# EAGLE design RingTop (EAGLE 9.6.2)
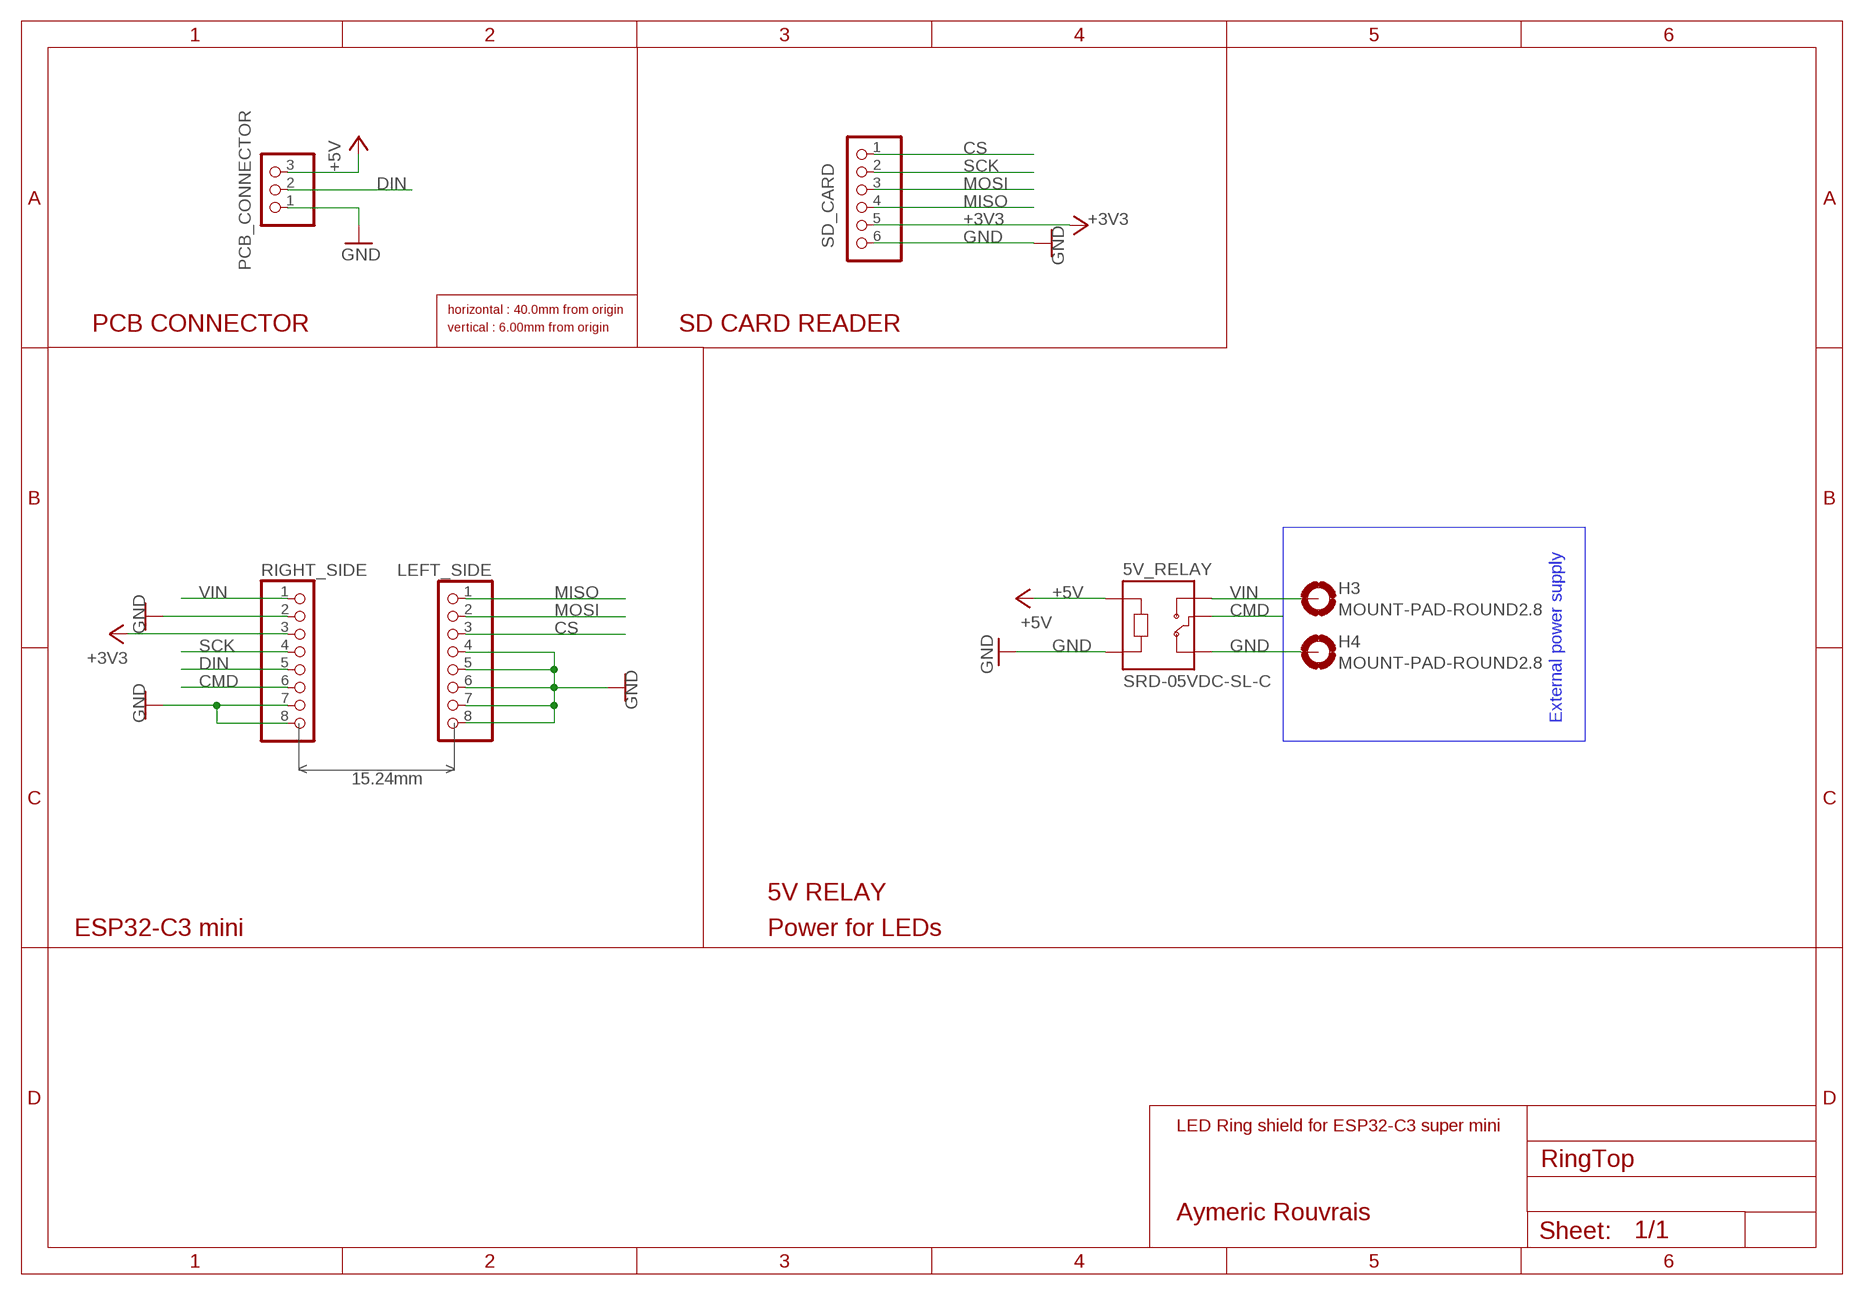
[diagram p0: schematic, sheet 1]

## Parts
5V_RELAY  SRD-05VDC-SL-C  [RELAY_SRD-05VDC-SL-C]
H3  MOUNT-PAD-ROUND2.8  [2,8-PAD]
H4  MOUNT-PAD-ROUND2.8  [2,8-PAD]
LEFT_SIDE  PINHD-1X8  [1X08]
PCB_CONNECTOR  PINHD-1X3  [1X03]
RIGHT_SIDE  PINHD-1X8  [1X08]
SD_CARD  PINHD-1X6/90  [1X06/90]

## Nets
+3V3: RIGHT_SIDE.3 SD_CARD.5
+5V: 5V_RELAY.A1 PCB_CONNECTOR.3
CMD: 5V_RELAY.COM RIGHT_SIDE.6
CS: LEFT_SIDE.3 SD_CARD.1
DIN: PCB_CONNECTOR.2 RIGHT_SIDE.5
GND: 5V_RELAY.A2 5V_RELAY.NC H4.B2,8(MOUNT) LEFT_SIDE.4 LEFT_SIDE.5 LEFT_SIDE.6 LEFT_SIDE.7 LEFT_SIDE.8 PCB_CONNECTOR.1 RIGHT_SIDE.2 RIGHT_SIDE.7 RIGHT_SIDE.8 SD_CARD.6
MISO: LEFT_SIDE.1 SD_CARD.4
MOSI: LEFT_SIDE.2 SD_CARD.3
SCK: RIGHT_SIDE.4 SD_CARD.2
VIN: 5V_RELAY.NO H3.B2,8(MOUNT) RIGHT_SIDE.1

## Notes on the sheet
- horizontal : 40.0mm from origin
- PCB CONNECTOR | vertical : 6.00mm from origin | SD CARD READER
- External power supply
- < | >
- 15.24mm
- 5V RELAY
- ESP32-C3 mini | Power for LEDs
- LED Ring shield for ESP32-C3 super mini
- Aymeric Rouvrais

## Library data of the parts
5V_RELAY = SRD-05VDC-SL-C:SRD-05VDC-SL-C: Check availability <https://pricing.snapeda.com/parts/SRD-05VDC-SL-C/Songle%20Relay/view-part?ref=eda>; AVAILABILITY: In Stock; CHECK_PRICES: https://www.snapeda.com/parts/SRD-05VDC-SL-C/Songle+Relay/view-part/?ref=eda; DESCRIPTION: 5V Trigger Relay Module For Arduino And Raspberry Pi 5V Trigger Relay Module For Arduino And Raspberry Pi; MF: Songle Relay; MP: SRD-05VDC-SL-C; PACKAGE: NON STANDARD-5 Songle Relay; PRICE: None; SNAPEDA_LINK: https://www.snapeda.com/parts/SRD-05VDC-SL-C/Songle+Relay/view-part/?ref=snap
H3 H4 = holes:MOUNT-PAD-ROUND: MOUNTING PAD, round
LEFT_SIDE RIGHT_SIDE = pinhead:PINHD-1X8: PIN HEADER
PCB_CONNECTOR = pinhead:PINHD-1X3: PIN HEADER
SD_CARD = pinhead:PINHD-1X6: PIN HEADER

## Board
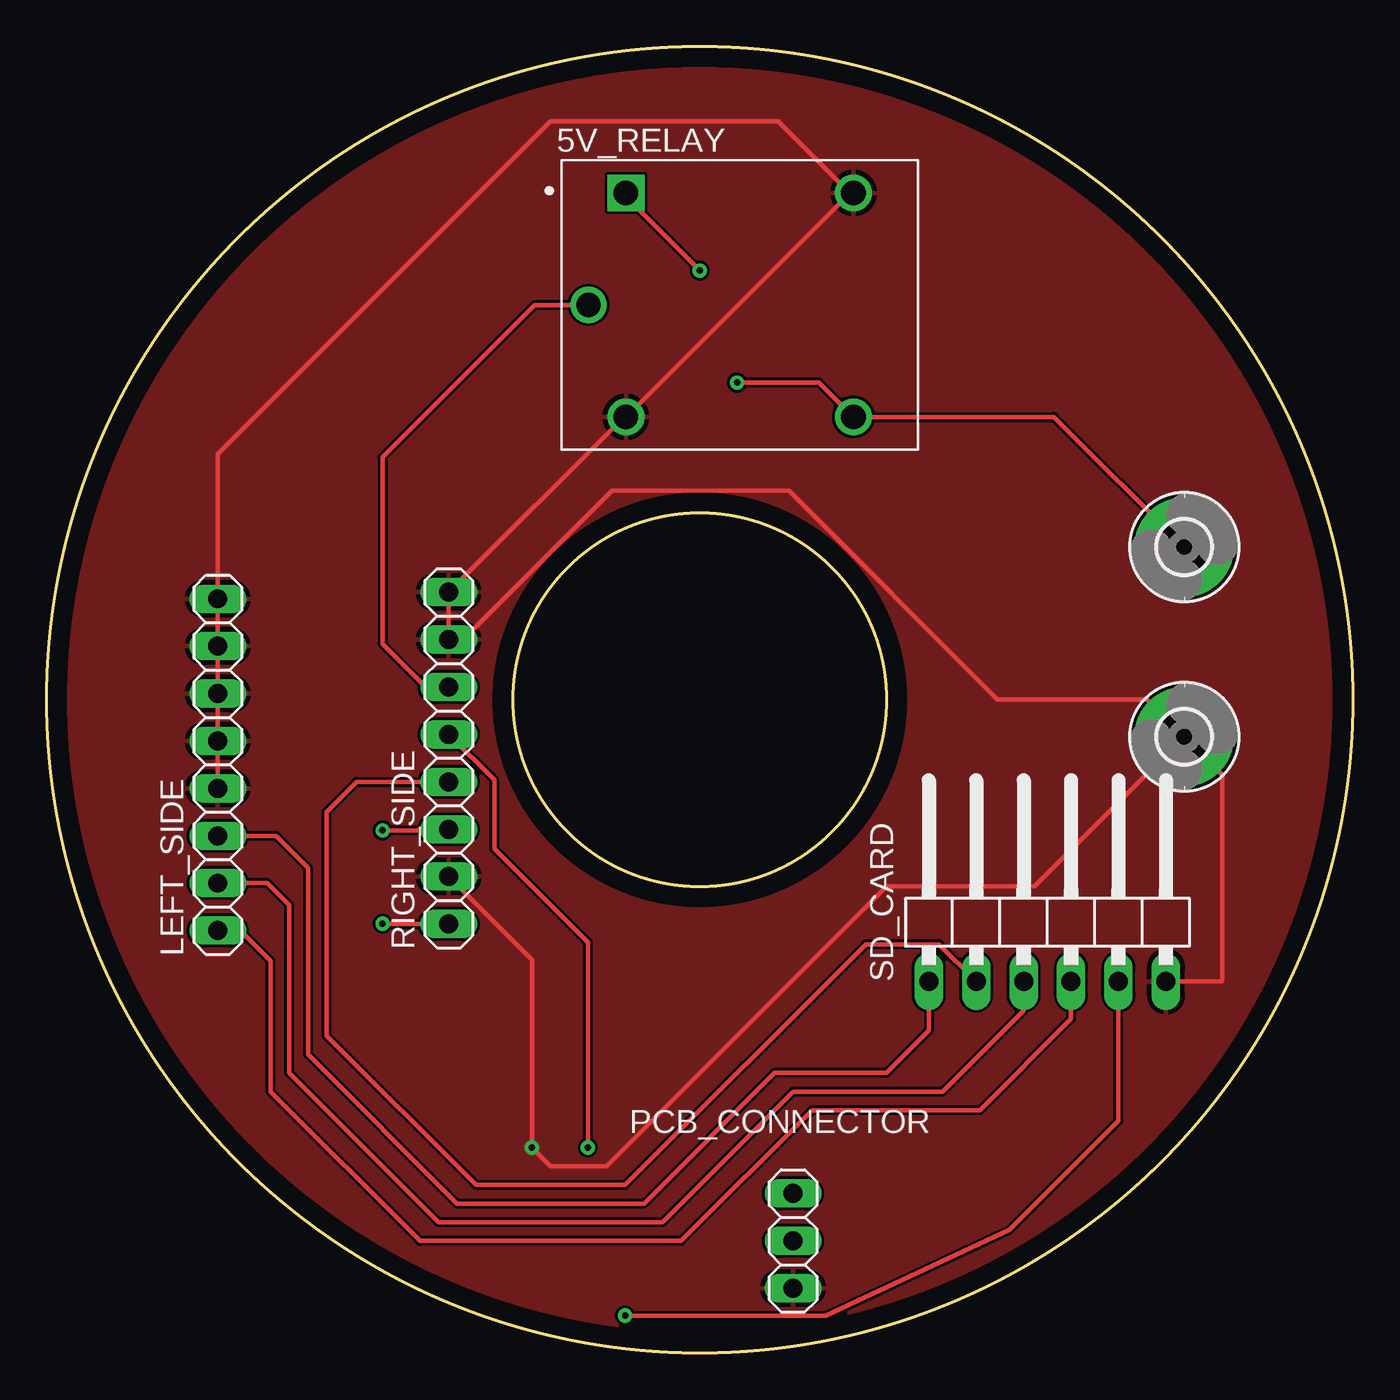
[diagram p1: board, top side]
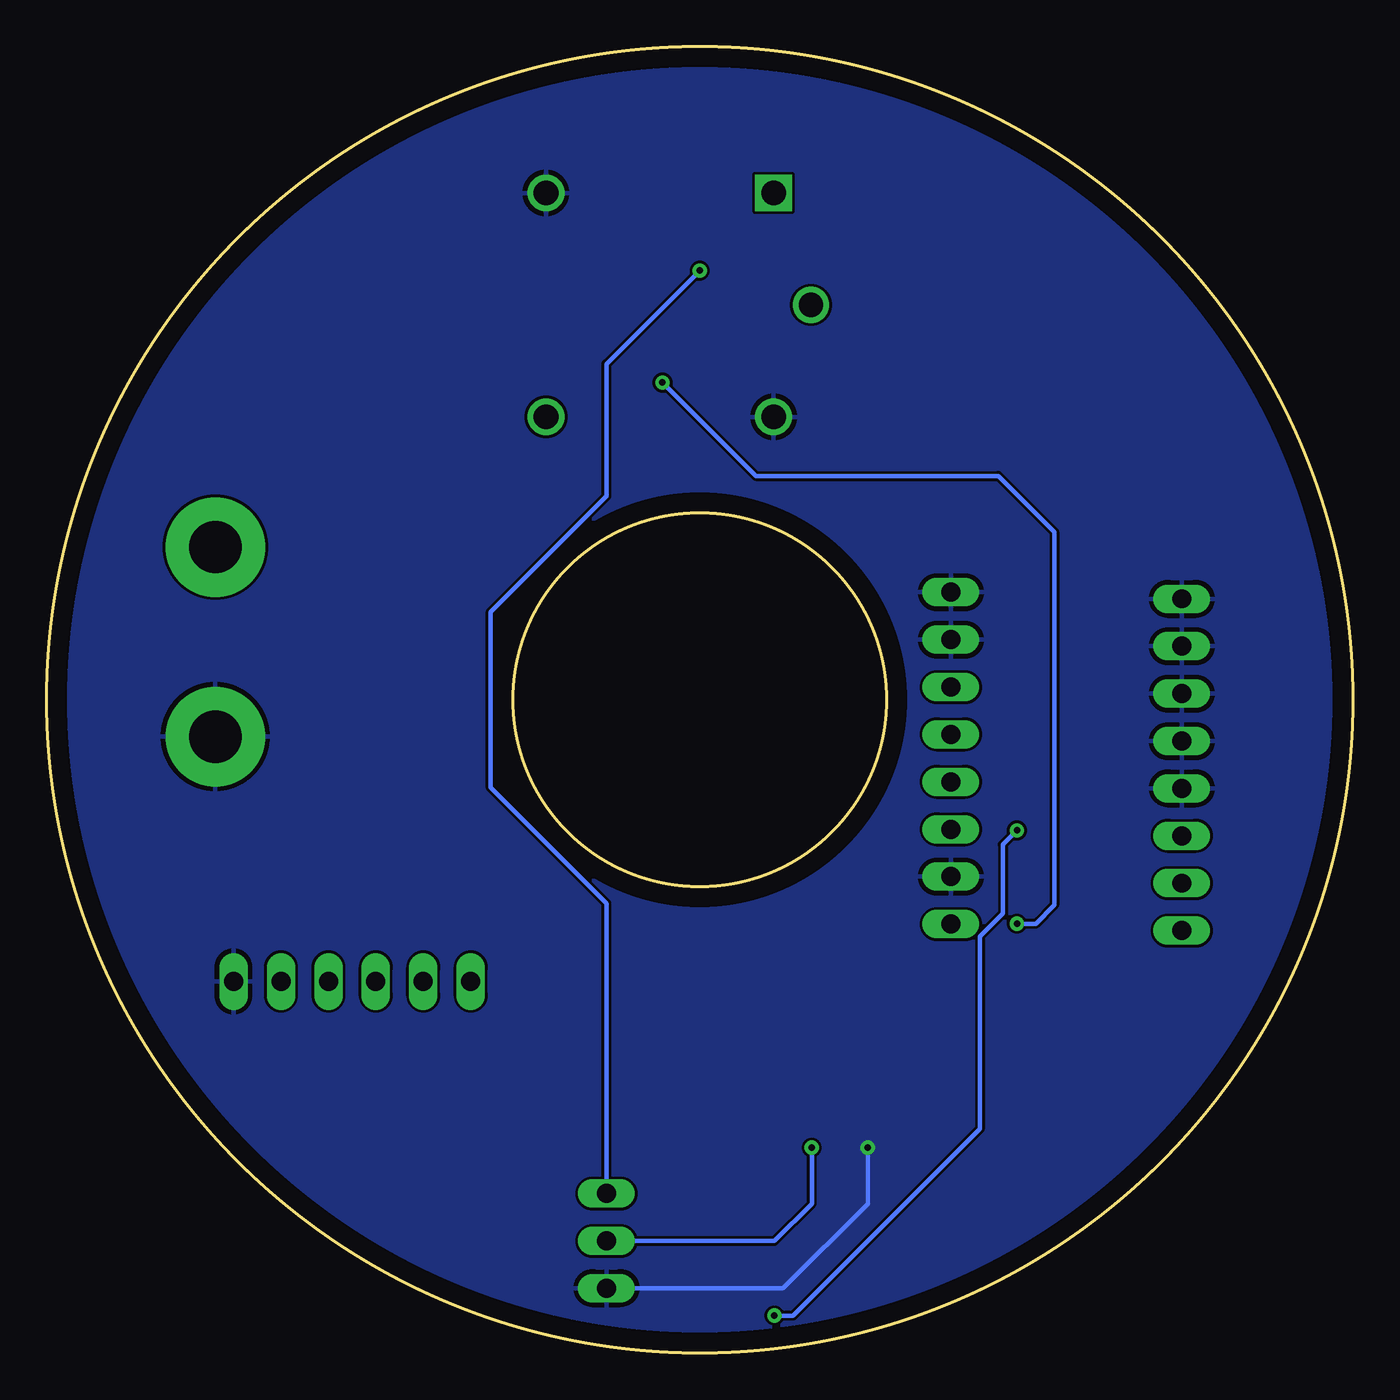
[diagram p2: board, bottom side, seen from below]

Size 70 x 70 mm. Coordinates in mm from the lower left corner, seen from the top.
Outline: circle at 35,35 radius 10
Outline: circle at 35,35 radius 35
Copper layers (1*16): Top 0.035mm / dielectric 1.5mm / Bottom 0.035mm
Design rules "default": minimum track width 6mil, minimum drill 0.35mm, track to track 6mil, track to pad 6mil, pad to pad 6mil, via to via 6mil, smd to smd 6mil, copper to edge 40mil, drill to drill 6mil, minimum pad ring 10mil, minimum via ring 8mil, stop-mask expansion 4mil, vias tented up to drill 0mil, thermal gap 10mil

### Footprints (pad centres in the part's own frame; a part is rotated, then mirrored left to right if it is on the bottom)
RELAY_SRD-05VDC-SL-C = drill 1.32 square: A1 -6.1,6 | drill 1.32: A2 -6.1,-6; NC 6.1,6; NO 6.1,-6 | drill 1.29: COM -8.1,0
2,8-PAD = drill 2.8 pad 5.334: B2,8 0,0
1X08 = drill 1.016 long: 1 -8.89,0; 2 -6.35,0; 3 -3.81,0; 4 -1.27,0; 5 1.27,0; 6 3.81,0; 7 6.35,0; 8 8.89,0
1X03 = drill 1.016 long: 1 -2.54,0; 2 0,0; 3 2.54,0
1X06/90 = drill 1.016 long: 1 -6.35,-3.81; 2 -3.81,-3.81; 3 -1.27,-3.81; 4 1.27,-3.81; 5 3.81,-3.81; 6 6.35,-3.81

### Placement (x,y rotation side)
5V_RELAY  37.14,56.16 0 top
H3  60.96,43.18 0 top
H4  60.96,33.02 0 top
LEFT_SIDE  9.17,31.52 90 top
PCB_CONNECTOR  40,6 90 top
RIGHT_SIDE  21.55,31.87 90 top
SD_CARD  53.63,23.71 0 top

### Tracks (layer width: path | path; a pad name or v marks a point on that pad's centre or on a via)
+3V3  (via drill 0.35)
  Top 0.229: RIGHT_SIDE.3 21.49,28 v18,28 | v31,2 41.74,2 51.59,6.59 57.44,12.44 SD_CARD.5
  Bottom 0.229: v18,28 18.76,27.24 18.76,23.55 20,22.31 20,12 30,2 v31,2
+5V  (via drill 0.35)
  Top 0.229: v35,58 31.04,61.96 5V_RELAY.A1
  Bottom 0.229: v35,58 40,53 40,45.91 46.21,39.7 46.21,30.3 40,24.09 PCB_CONNECTOR.3
CMD
  Top 0.229: 5V_RELAY.COM 26.16,56.16 18,48 18,38 20.32,35.68 RIGHT_SIDE.6
CS
  Top 0.229: SD_CARD.1 47.28,17.28 45,15 39,15 32,8 22,8 14,16 14,26 12.29,27.71 LEFT_SIDE.3
DIN  (via drill 0.35)
  Top 0.229: v29,11 29,22 24,27 24,30.69 RIGHT_SIDE.5
  Bottom 0.229: PCB_CONNECTOR.2 31,6 29,8 v29,11
GND  (via drill 0.35)
  Top 0.152: LEFT_SIDE.8 LEFT_SIDE.7 LEFT_SIDE.6 LEFT_SIDE.5 LEFT_SIDE.4
  Top 0.229: LEFT_SIDE.4 LEFT_SIDE.8 9.17,48.17 27,66 39.2,66 43.04,62.16 | RIGHT_SIDE.2 26,21.07 v26,11 27,10 30,10 45,25 52.94,25 H4.B2,8 | SD_CARD.6 62.98,19.9 62.94,19.94 63,20 63,30.98 H4.B2,8 | H4.B2,8 58.96,35.02 50.96,35.02 39.77,46.21 30.3,46.21 22.31,38.22 RIGHT_SIDE.7 RIGHT_SIDE.8 30.95,50.16 5V_RELAY.A2 43.04,62.16 | 43.04,62.16 5V_RELAY.NC
  Bottom 0.229: PCB_CONNECTOR.1 30.54,3.46 26,8 v26,11
  pour Top: -2,7 7,-2 65,-2 72,5 72,66 66,72 4,72 -2,66
  pour Bottom: -2,66 -2,7 7,-2 65,-2 72,5 72,66 66,72 4,72
MISO
  Top 0.229: SD_CARD.4 54.9,17.9 50,13 41,13 34,6 20,6 12,14 12,21 10.37,22.63 LEFT_SIDE.1
MOSI
  Top 0.229: SD_CARD.3 52.36,18.36 48,14 40,14 33,7 21,7 13,15 13,24 11.83,25.17 LEFT_SIDE.2
SCK
  Top 0.229: SD_CARD.2 47.82,21.9 43.9,21.9 31,9 23,9 15,17 15,29 16.6,30.6 RIGHT_SIDE.4
VIN  (via drill 0.35)
  Top 0.229: H3.B2,8 53.98,50.16 5V_RELAY.NO 41.4,52 v37,52 | v18,23 21.53,23 RIGHT_SIDE.1
  Bottom 0.229: v18,23 17,23 16,24 16,44 19,47 32,47 v37,52